# EAGLE design Pihome Boiler Relay (EAGLE 9.0.1)
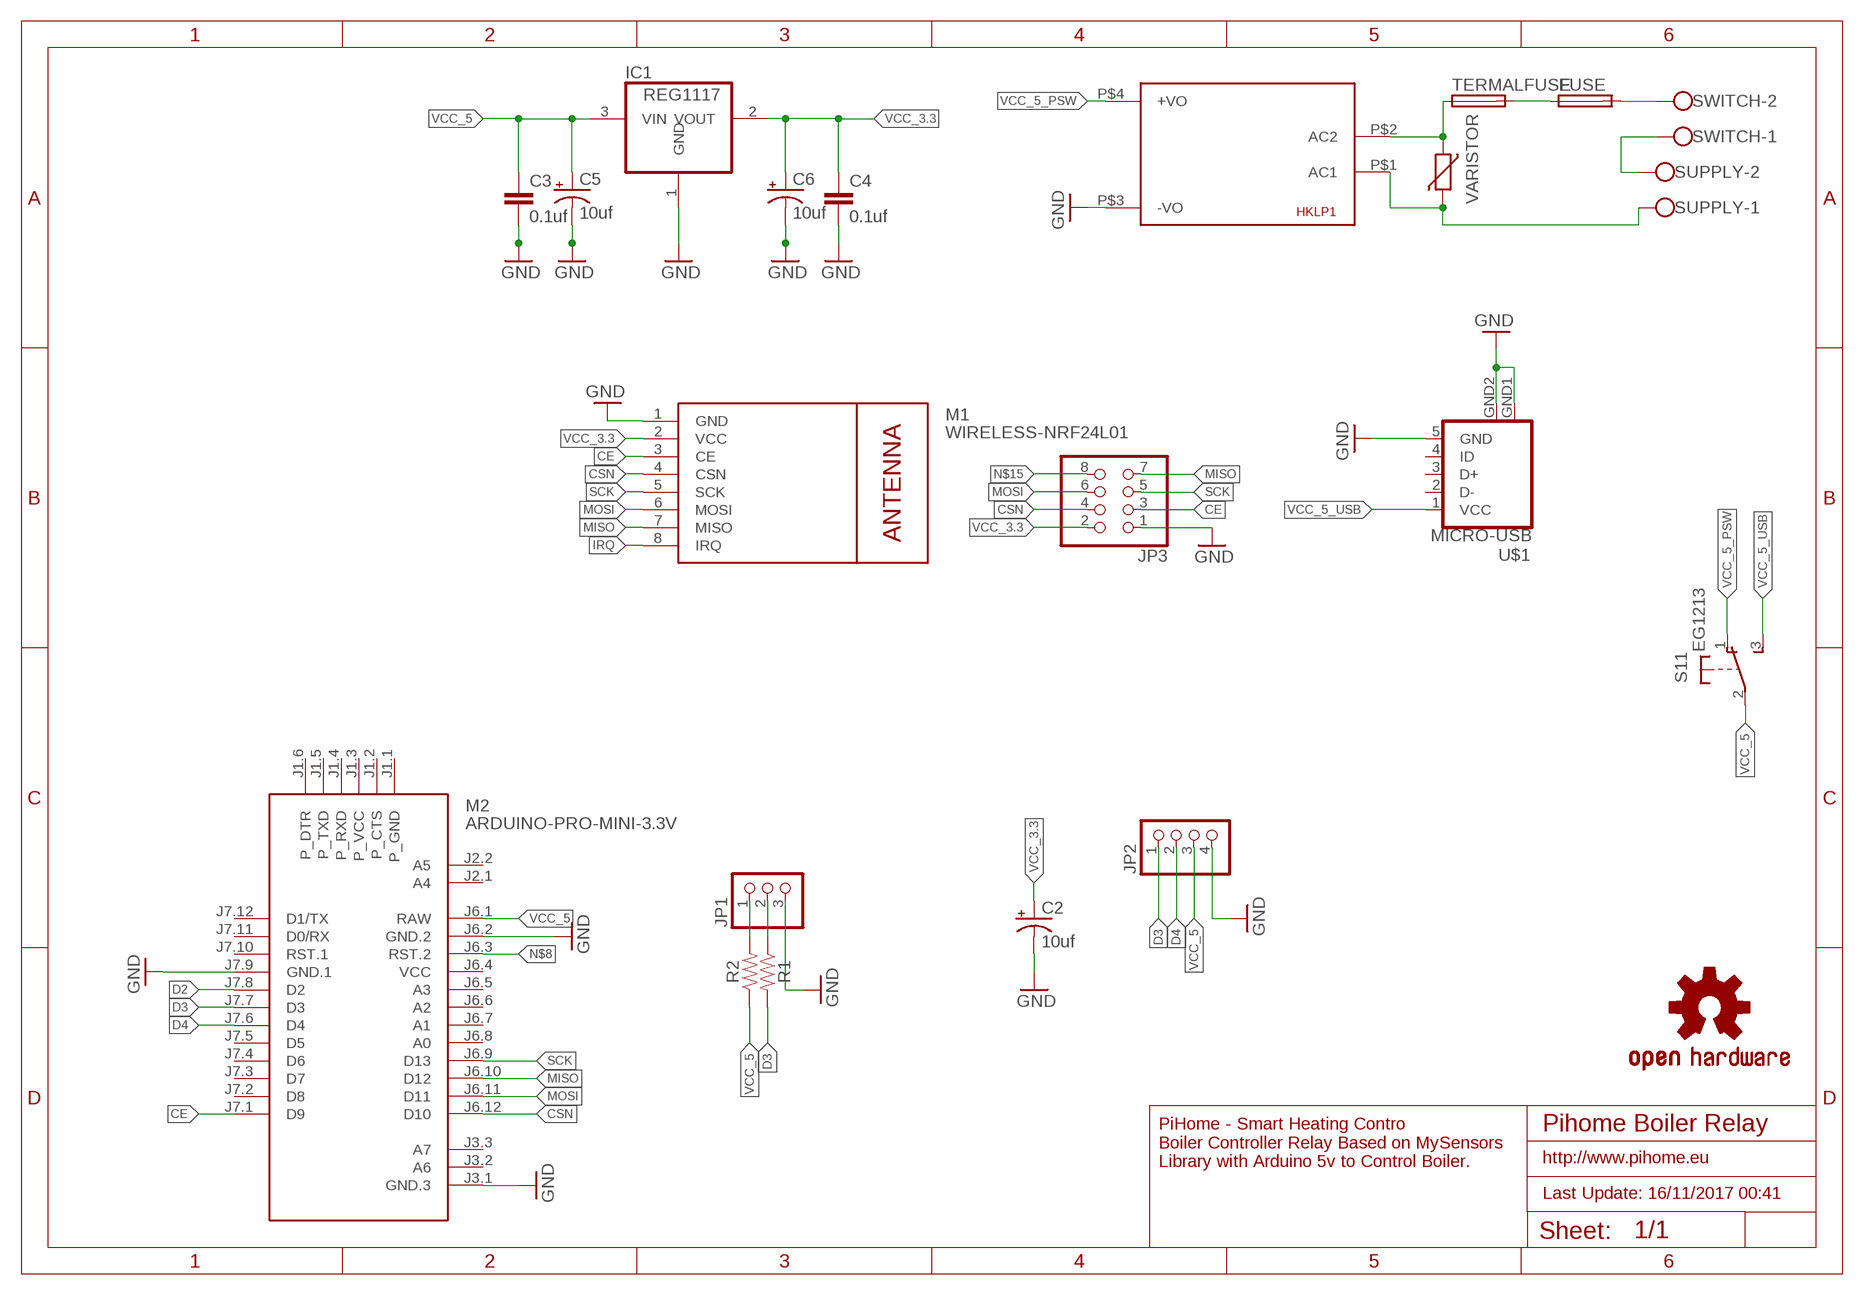
[diagram p0: schematic, sheet 1]

## Parts
C2  10uf  10UF-25V-20%(PTH)KIT  [CPOL-RADIAL-10UF-25V-KIT]
C3  0.1uf  0.1UF-50V-20%(PTH)KIT-EZ  [CAP-PTH-SMALL-KIT]
C4  0.1uf  0.1UF-50V-20%(PTH)KIT-EZ  [CAP-PTH-SMALL-KIT]
C5  10uf  10UF-25V-20%(PTH)KIT  [CPOL-RADIAL-10UF-25V-KIT]
C6  10uf  10UF-25V-20%(PTH)KIT  [CPOL-RADIAL-10UF-25V-KIT]
FUSE  TE5  [TE5]
HKLP1  HKLPM01  [HKLPM01]
IC1  REG1117  [SOT223]
JP1  PINHD-1X3  [1X03]
JP2  PINHD-1X4  [1X04]
JP3  PINHD-2X4  [2X04]
LOGO1  OSHW-LOGOL  [OSHW-LOGO-L]
M1  WIRELESS-NRF24L01  [WIRELESS-NRF24L01]
M2  ARDUINO-PRO-MINI-3.3V  [ARDUINO-PRO-MINI]
R1  RESISTORAXIAL-0.3  [AXIAL-0.3]
R2  RESISTORAXIAL-0.3  [AXIAL-0.3]
S1  EG1213  [EG1213]
SUPPLY  W237-102  [W237-102]
SWITCH  W237-102  [W237-102]
TERMALFUSE  TE5  [TE5]
U$1  MICRO-USB  [MICRO-USB]
VARISTOR  VARISTOR-7,5  [R-7,5]

## Nets
CE: JP3.3 M1.3(CE) M2.J7.1(D9)
CSN: JP3.4 M1.4(CSN) M2.J6.12(D10)
D2: M2.J7.8(D2)
D3: JP2.1 M2.J7.7(D3) R1.P$2
D4: JP2.2 M2.J7.6(D4)
GND: C2.2(-) HKLP1.P$3(-VO) JP1.3 JP2.4 JP3.1 M1.1(GND) M2.J3.1(GND.3) M2.J6.2(GND.2) M2.J7.9(GND.1) U$1.5(GND) U$1.GND1(GND) U$1.GND2(GND)
GND-: C3.2 C4.2 C5.2(-) C6.2(-) IC1.1(GND) ; supply symbol labelled GND
IRQ: M1.8(IRQ)
MISO: JP3.7 M1.7(MISO) M2.J6.10(D12)
MOSI: JP3.6 M1.6(MOSI) M2.J6.11(D11)
N$1: SUPPLY.2 SWITCH.1
N$2: FUSE.1 TERMALFUSE.2
N$3: HKLP1.P$2(AC2) TERMALFUSE.1 VARISTOR.1
N$4: HKLP1.P$1(AC1) SUPPLY.1 VARISTOR.2
N$5: JP1.2 R1.P$1
N$6: JP1.1 R2.P$2
N$7: FUSE.2 SWITCH.2
N$8: M2.J6.3(RST.2)
N$15: JP3.8
SCK: JP3.5 M1.5(SCK) M2.J6.9(D13)
VCC_3.3: C2.1(+) C4.1 C6.1(+) IC1.2(VOUT) JP3.2 M1.2(VCC)
VCC_5: C3.1 C5.1(+) IC1.3(VIN) JP2.3 M2.J6.1(RAW) R2.P$1 S1.2(1:P)
VCC_5_PSW: HKLP1.P$4(+VO) S1.1(1:O)
VCC_5_USB: S1.3(1:S) U$1.1(VCC)
Unconnected: M2.J1.1(P_GND) M2.J1.2(P_CTS) M2.J1.3(P_VCC) M2.J1.4(P_RXD) M2.J1.5(P_TXD) M2.J1.6(P_DTR) M2.J2.1(A4) M2.J2.2(A5) M2.J3.2(A6) M2.J3.3(A7) M2.J6.5(A3) M2.J6.6(A2) M2.J6.7(A1) M2.J6.8(A0) M2.J7.2(D8) M2.J7.3(D7) M2.J7.4(D6) M2.J7.5(D5) M2.J7.10(RST.1) M2.J7.11(D0/RX) M2.J7.12(D1/TX) S1.MT1(MT) S1.MT2(MT) U$1.2(D-) U$1.3(D+) U$1.4(ID)

## Notes on the sheet
- http://www.pihome.eu
- PiHome - Smart Heating Contro
  Boiler Controller Relay Based on MySensors 
  Library with Arduino 5v to Control Boiler.
- Last Update: 16/11/2017 00:41

## Power pins joined to a net without a drawn wire
VCC: M2.J6.4(VCC)

## Library data of the parts
C2 C5 C6 = SparkFun-Capacitors:10UF-25V-20%(PTH): CAP-08440; PROD_ID: CAP-08440
C3 C4 = SparkFun-Capacitors:0.1UF-50V-20%(PTH): CAP-08370; PROD_ID: CAP-08370
FUSE TERMALFUSE = fuse:TE5: FUSE Wickmann; OC_FARNELL: unknown; OC_NEWARK: unknown
HKLP1 = HKLPM01:HKLPM01
IC1 = burr-brown:REG1117: 800mA and 1A Low Dropout (LDO) Positive Regulator 1.8V, 2.5V, 2.85V, 3.3V, 5V, and Adj; MPN: REG1117; OC_FARNELL: 1097566; OC_NEWARK: 14P6981
JP1 = adafruit:PINHD-1X3: PIN HEADER
JP2 = pinhead:PINHD-1X4: PIN HEADER
JP3 = adafruit:PINHD-2X4: PIN HEADER
LOGO1 = SparkFun-Aesthetics:OSHW-LOGO: Open Source Hardware Logo This logo indicates the piece of hardware it is found on incorporates a OSHW license and/or adheres to the definition of open source hardware found here: http://freedomdefined.org/OSHW
M1 = diy-modules:WIRELESS-NRF24L01: 2.4 GHz Wireless Module based on NRF24L01 chip More details available here: http://www.electrodragon.com/w/NRF24L01 Click here to find device on ebay.com <http://www.ebay.com/sch/nrf24l01+arduino>
M2 = diy-modules:ARDUINO-PRO-MINI-*: Arduino Pro Mini and compatible devices More details available here: https://www.arduino.cc/en/Main/ArduinoBoardProMini Click here to find device on ebay.com <http://www.ebay.com/sch/arduino+pro+mini>
R1 R2 = SparkFun-Resistors:RESISTOR: Generic Resistor Package
S1 = adafruit:EG1213: E-Switch right-angle slide SPDT Part #EG1213 http://www.ladyada.net/library/eagle
SUPPLY SWITCH = con-wago-500:W237-102: WAGO SCREW CLAMP; MPN: 237-102; OC_FARNELL: unknown; OC_NEWARK: 70K9898
U$1 = microusb:MICRO-USB: Micro USB B connector
VARISTOR = varistor:VARISTOR: VARISTOR

## Net classes
0 default: width 0.305 mm, drill 0.508 mm, clearance 0.254 mm

## Board
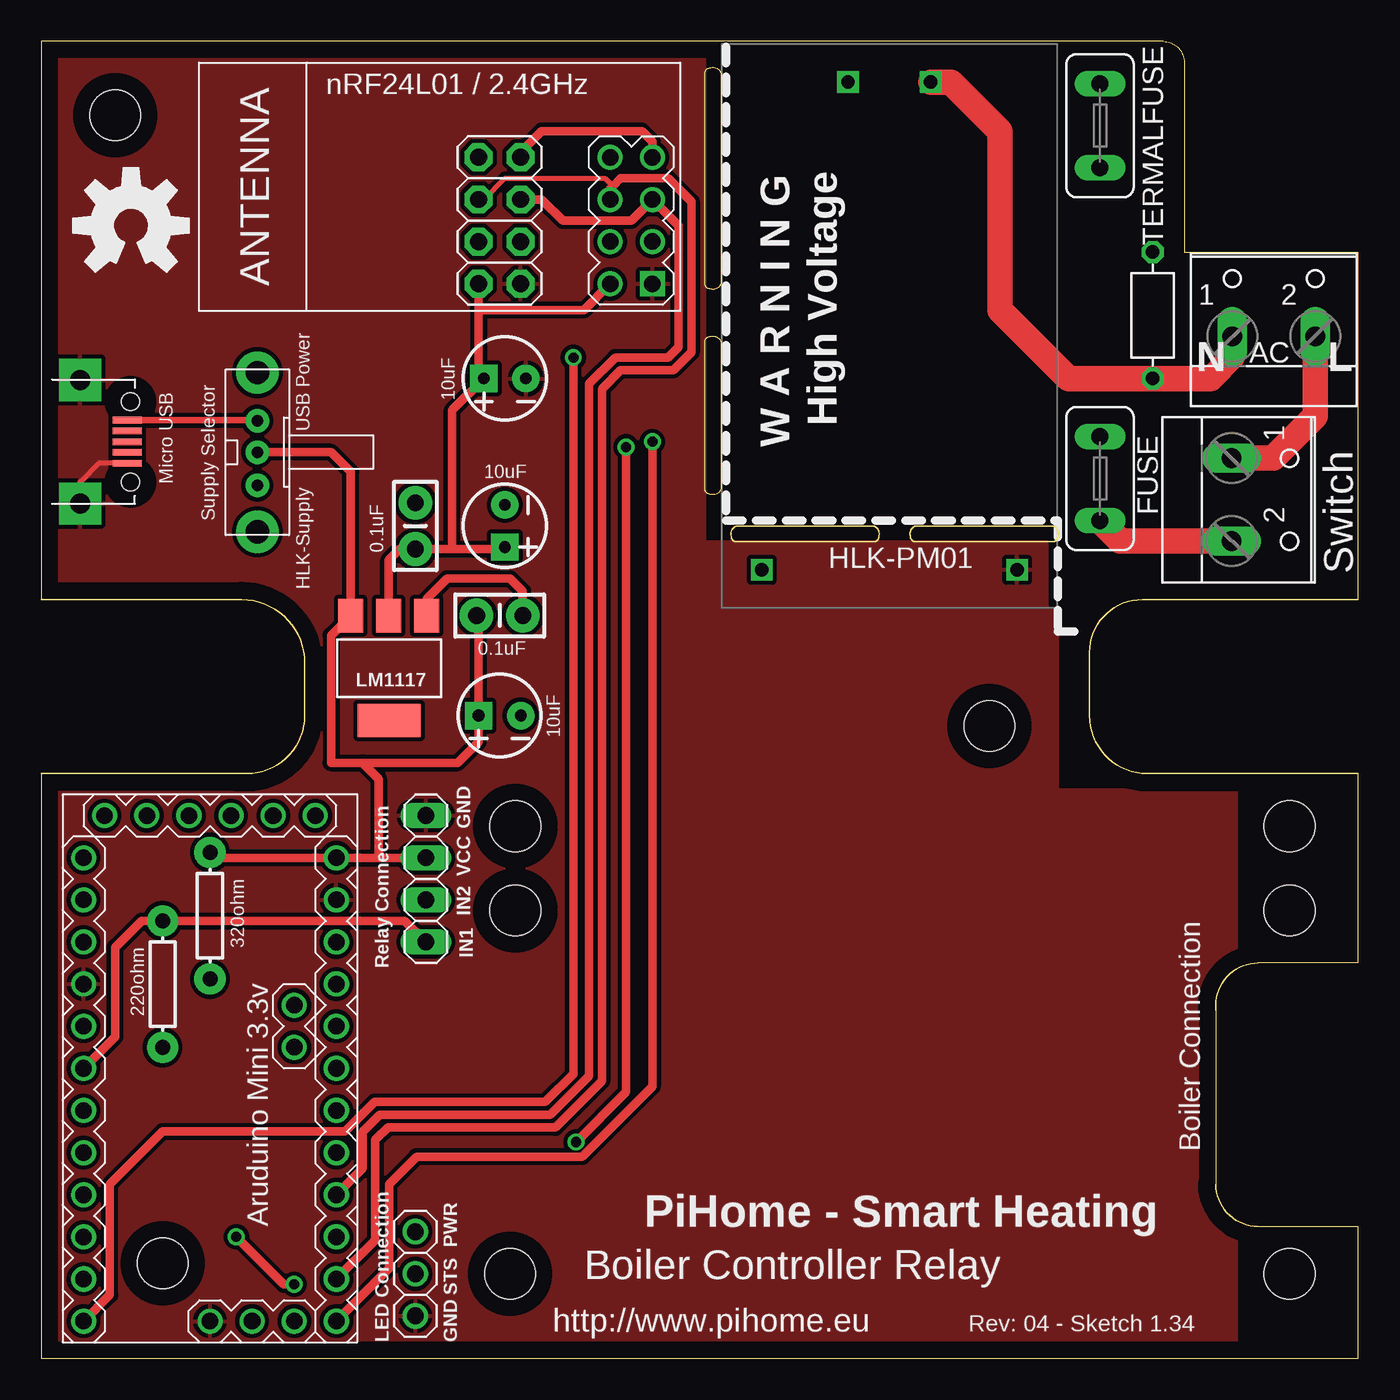
[diagram p1: board, top side]
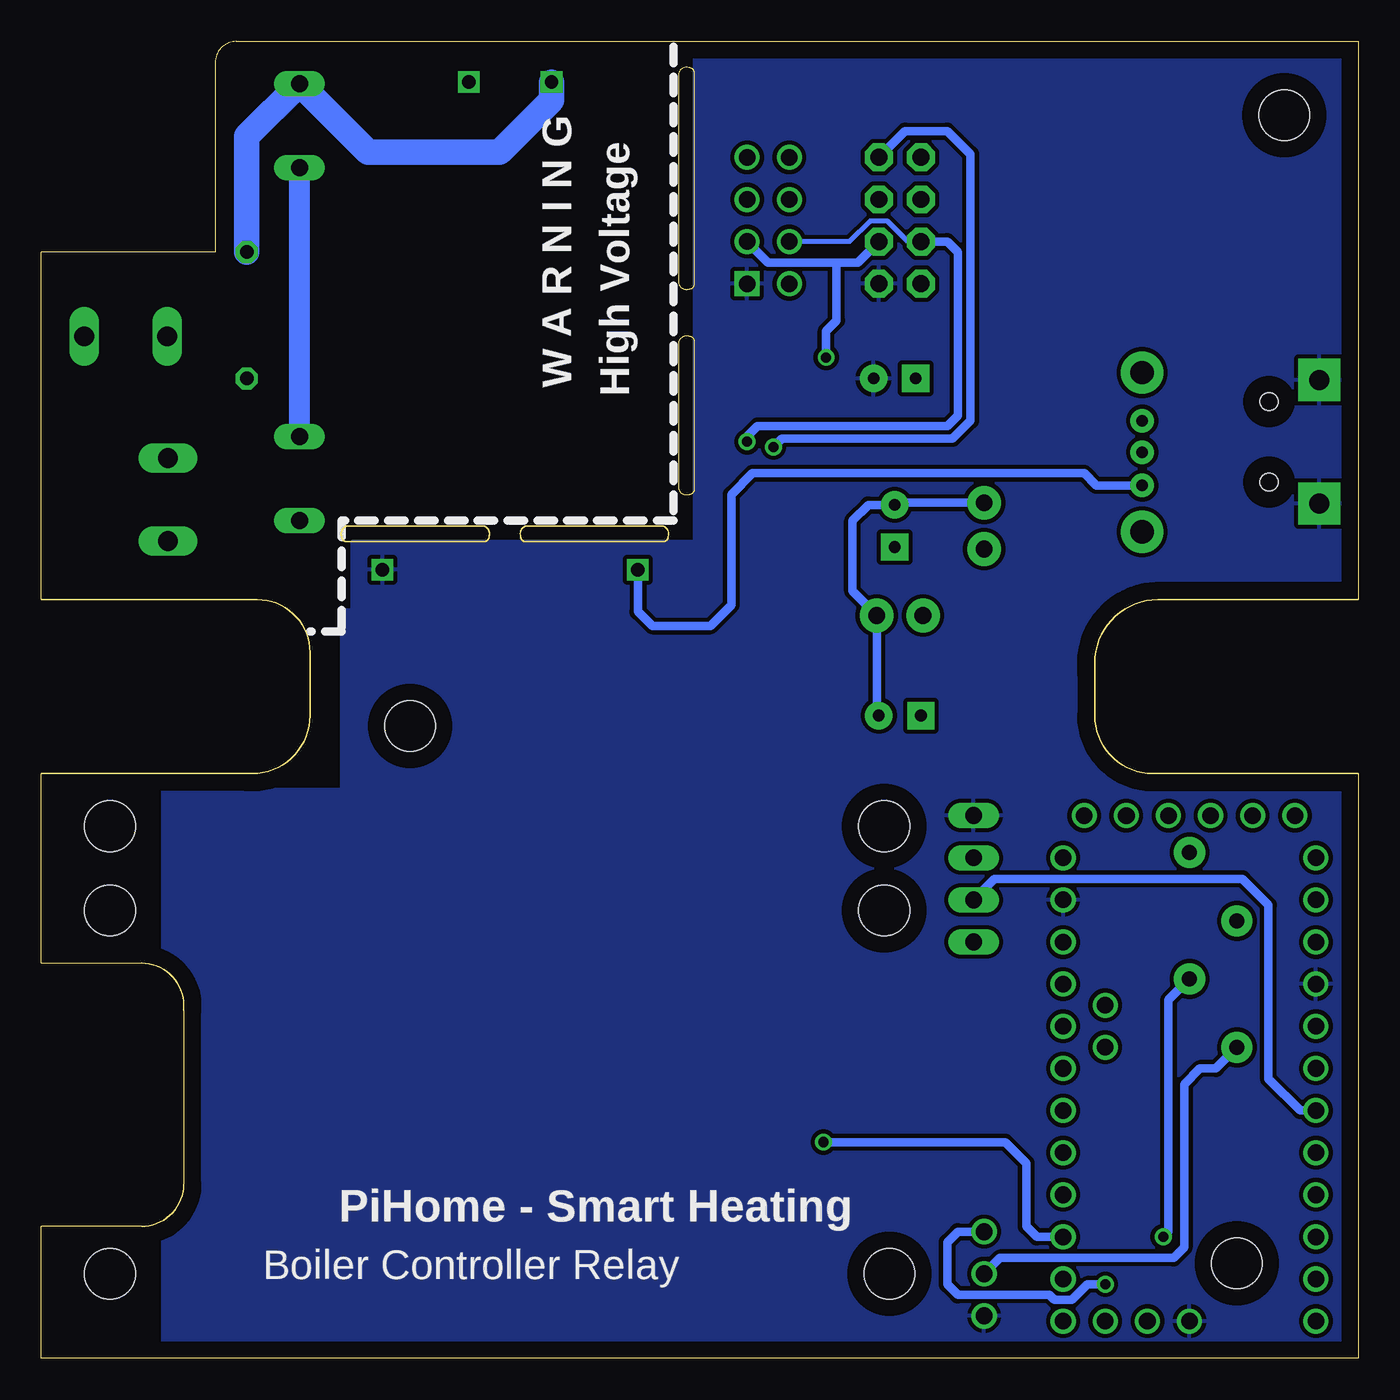
[diagram p2: board, bottom side, seen from below]

Size 79.38 x 79.38 mm. Coordinates in mm from the lower left corner, seen from the top.
Outline: 0,0 79.38,0 79.38,7.94 73.34,7.94 arc-90 70.8,10.48 70.8,20.95 70.8,21.27 arc-90 73.34,23.81 79.38,23.81 79.38,35.24 66.99,35.24 66.67,35.24 arc-90 63.18,38.73 63.18,41.91 63.18,42.55 arc-90 66.36,45.72 79.38,45.72 79.38,66.67 68.9,66.67 68.9,78.11 arc90 67.63,79.38 0,79.38 0,45.72 12.06,45.72 arc-90 15.88,41.91 15.88,41.27 15.88,38.73 arc-90 12.38,35.24 11.75,35.24 0,35.24 0,0
Copper layers (1*16): Top 0.035mm / dielectric 1.5mm / Bottom 0.035mm
Design rules "default": minimum track width 10mil, minimum drill 24mil, track to track 8mil, track to pad 8mil, pad to pad 8mil, via to via 8mil, smd to smd 8mil, copper to edge 40mil, drill to drill 8mil, minimum pad ring 10mil, minimum via ring 8mil, stop-mask expansion 4mil, vias tented up to drill 0mil, thermal gap 10mil
Holes 3.05 mm at 75.25,26.99 28.26,5.08 75.25,5.08 28.57,26.99 75.25,32.07 28.57,32.07 4.45,74.93 57.15,38.1 7.3,5.71
Milling: area 40,64.4 to 41,77.8; area 40,52 to 41,61.6; area 41.6,49.2 to 50.5,50.2; area 52.4,49.2 to 61.3,50.2

### Footprints (pad centres in the part's own frame; a part is rotated, then mirrored left to right if it is on the bottom)
CPOL-RADIAL-10UF-25V-KIT = drill 0.7 pad 1.651 square: 1 1.27,0 | drill 0.7 pad 1.651: 2 -1.27,0
CAP-PTH-SMALL-KIT = drill 1.016 pad 2.032: 1 -1.397,0; 2 1.397,0
TE5 = drill 1.016 long: 1 -2.54,0; 2 2.54,0
HKLPM01 = drill 0.8 square: P$1 -14.7,2.5; P$2 -14.7,-2.5; P$3 14.7,7.7; P$4 14.7,-7.7
SOT223 = smd 1.499 x 2.007: 1 -2.261,-3.15; 2 0.025,-3.15; 3 2.311,-3.15 | smd 3.81 x 2.007: 4 0,3.15
1X03 = drill 1.016: 1 -2.54,0; 2 0,0; 3 2.54,0
1X04 = drill 1.016 long: 1 -3.81,0; 2 -1.27,0; 3 1.27,0; 4 3.81,0
2X04 = drill 1.016 pad 1.676 octagon: 1 -3.81,-1.27; 2 -3.81,1.27; 3 -1.27,-1.27; 4 -1.27,1.27; 5 1.27,-1.27; 6 1.27,1.27; 7 3.81,-1.27; 8 3.81,1.27
WIRELESS-NRF24L01 = drill 1 square: 1 -12.7,6.35 | drill 1: 2 -10.16,6.35; 3 -12.7,3.81; 4 -10.16,3.81; 5 -12.7,1.27; 6 -10.16,1.27; 7 -12.7,-1.27; 8 -10.16,-1.27
ARDUINO-PRO-MINI = drill 1: J1.1 -15.24,6.35; J1.2 -15.24,3.81; J1.3 -15.24,1.27; J1.4 -15.24,-1.27; J1.5 -15.24,-3.81; J1.6 -15.24,-6.35; J2.1 -1.27,5.08; J2.2 -3.81,5.08; J3.1 15.24,0; J3.2 15.24,2.54; J3.3 15.24,5.08; J6.1 -12.7,7.62; J6.2 -10.16,7.62; J6.3 -7.62,7.62; J6.4 -5.08,7.62; J6.5 -2.54,7.62; J6.6 0,7.62; J6.7 2.54,7.62; J6.8 5.08,7.62; J6.9 7.62,7.62; J6.10 10.16,7.62; J6.11 12.7,7.62; J6.12 15.24,7.62; J7.1 15.24,-7.62; J7.2 12.7,-7.62; J7.3 10.16,-7.62; J7.4 7.62,-7.62; J7.5 5.08,-7.62; J7.6 2.54,-7.62; J7.7 0,-7.62; J7.8 -2.54,-7.62; J7.9 -5.08,-7.62; J7.10 -7.62,-7.62; J7.11 -10.16,-7.62; J7.12 -12.7,-7.62
AXIAL-0.3 = drill 0.9 pad 1.88: P$1 -3.81,0; P$2 3.81,0
EG1213 = drill 0.7 pad 1.422: 1 -2,0; 2 0,0; 3 1.9,0 | drill 1.4 pad 2.54: MT1 -4.8,0; MT2 4.8,0
W237-102 = drill 1.194 long: 1 -2.5,-1.27; 2 2.5,-1.27
MICRO-USB = smd 0.4 x 1.75: 1 -1.3,4.525; 2 -0.65,4.525; 3 0,4.525; 4 0.65,4.525; 5 1.3,4.525 | drill 1.2 pad 2.54 square: GND1 -3.725,1.7; GND2 3.725,1.7 | hole 1.05: -2.425,4.73; 2.425,4.73
R-7,5 = drill 0.813 octagon: 1 -3.81,0; 2 3.81,0

### Placement (x,y rotation side)
C2  27.94,59.05 180 top
C3  27.62,44.77 0 top
C4  22.54,50.16 90 top
C5  27.62,38.73 180 top
C6  27.94,50.16 270 top
FUSE  63.82,53.02 270 top
HKLP1  51.12,62.23 270 top
IC1  20.95,41.59 180 top
JP1  22.54,5.08 270 top
JP2  23.18,28.89 90 top
JP3  27.62,68.58 90 top
LOGO1  5.4,68.26 0 top
M1  24.13,71.12 180 top
M2  10.16,17.46 270 top
R1  7.3,22.54 90 top
R2  10.16,26.67 270 top
S1  13.02,54.61 90 top
SUPPLY  74.3,62.87 0 top
SWITCH  73.03,51.75 270 top
TERMALFUSE  63.82,74.3 270 top
U$1  0.64,55.24 270 top
VARISTOR  66.99,62.87 270 top

### Tracks (layer width: path | path; a pad name or v marks a point on that pad's centre or on a via)
CE  (via drill 0.61)
  Top 0.508: v32.07,60.33 32.07,17.14 30.35,15.43 20.07,15.43 18.3,13.65 7.3,13.65 4.13,10.48 4.13,3.81 M2.J7.1
  Bottom 0.508: v32.07,60.33 32.07,61.91 31.43,62.55 31.43,66.04 | M1.3 35.56,66.04 31.43,66.04 | JP3.3 30.16,66.04 31.43,66.04
CSN  (via drill 0.61)
  Top 0.508: M2.J6.12 20.95,5.4 20.95,10.48 22.61,12.13 32.59,12.13 36.83,16.37 v36.83,55.24
  Bottom 0.305: JP3.4 27.13,67.31 28.38,68.56 29.41,68.56 30.65,67.31 M1.4
  Bottom 0.508: JP3.4 24.77,67.31 24.13,66.67 24.13,56.83 24.77,56.2 36.2,56.2 36.83,55.56 v36.83,55.24
D3
  Top 0.508: M2.J7.7 4.45,19.37 4.45,24.77 6.03,26.35 R1.P$2 21.91,26.35 JP2.1
D4
  Bottom 0.508: M2.J7.6 3.49,14.92 5.4,16.83 5.4,27.3 6.98,28.88 21.92,28.88 JP2.2
GND
  Top 0.305: U$1.GND2 2.33,52.82 3.46,53.95 U$1.5
  pour Top: 0,79.06 40.01,79.06 40.01,49.21 60.64,49.21 60.64,45.09 61.28,45.09 61.28,34.29 72.07,34.29 72.07,0 0,0
  pour Bottom: 0,79.06 40.01,79.06 40.01,49.21 60.64,49.21 60.64,45.09 61.28,45.09 61.28,34.29 72.07,34.29 72.07,0 0,0
GND-
  Top 0.305: 23.5,44.45 IC1.1
  Top 0.508: IC1.1 23.22,45.76 24.45,46.99 28.26,46.99 29.02,46.23 C3.2
  Bottom 0.508: C5.2 29.02,38.86 C3.2 30.48,46.23 30.48,50.48 29.53,51.44 C6.2 27.81,51.56 C4.2
MISO  (via drill 0.61)
  Top 0.508: M1.7 36.83,73.34 36.2,73.98 30.16,73.98 28.89,72.71 JP3.7 | v35.24,54.93 35.24,16.03 v32.23,13.02
  Bottom 0.508: M2.J6.10 19.37,7.3 20,7.94 20,11.75 21.27,13.02 v32.23,13.02 | JP3.7 27.3,73.98 24.77,73.98 23.37,72.58 23.37,56.52 24.45,55.44 34.73,55.44 v35.24,54.93
MOSI
  Top 0.305: JP3.6 26.67,69.85 27.94,71.12 33.97,71.12 34.45,70.64
  Top 0.508: M1.6 34.29,70.48 34.45,70.64 34.92,71.12 37.78,71.12 39.18,69.72 39.18,60.64 38.1,59.56 34.92,59.56 33.78,58.42 33.78,16.7 30.98,13.91 20.89,13.91 20.13,13.14 20.13,7.11 M2.J6.11
N$1
  Top 1.524: SWITCH.1 74.25,54.25 76.8,56.79 SUPPLY.2
N$2
  Bottom 1.27: FUSE.1 TERMALFUSE.2
N$3
  Bottom 1.524: VARISTOR.1 66.99,73.66 TERMALFUSE.1 59.69,72.71 51.75,72.71 48.62,75.84 HKLP1.P$2
N$4
  Top 1.524: HKLP1.P$1 54.83,76.93 57.78,73.98 57.78,63.18 61.91,59.05 VARISTOR.2 70.48,59.05 71.8,60.37 SUPPLY.1
N$5
  Bottom 0.508: JP1.2 21.59,6.03 11.11,6.03 10.48,6.67 10.48,16.51 9.53,17.46 8.57,17.46 R1.P$1
N$6  (via drill 0.61)
  Top 0.508: v11.75,7.3 14.61,4.45 v15.24,4.45
  Bottom 0.508: R2.P$2 11.43,21.59 11.43,7.62 v11.75,7.3 | v15.24,4.45 16.31,4.45 17.26,3.5 18.3,3.5 18.61,3.81 24.13,3.81 24.77,4.45 24.77,6.99 24.13,7.62 JP1.1
N$7
  Top 1.524: FUSE.2 65.05,49.25 SWITCH.2
SCK
  Top 0.508: JP3.5 30.16,69.85 31.43,68.58 35.56,68.58 M1.5 38.42,68.26 38.42,60.96 37.78,60.33 34.61,60.33 33.02,58.74 33.02,17.02 30.67,14.67 20.39,14.67 19.37,13.65 19.37,11.43 M2.J6.9
VCC_3.3
  Top 0.305: 20.95,45.09 IC1.2
  Top 0.508: M1.2 32.7,63.18 26.35,63.18 | JP3.2 26.35,63.18 | 26.35,63.18 26.35,59.37 C2.1 24.77,57.15 24.77,48.77 | 24.77,48.77 27.81,48.77 C6.1 | IC1.2 20.93,48.11 21.59,48.77 C4.1 24.77,48.77
VCC_5
  Top 0.305: 18.41,45.09 IC1.3 18.41,44.45
  Top 0.508: S1.2 17.46,54.61 18.64,53.43 IC1.3 17.46,43.56 17.46,35.88 19.37,35.88 | 19.37,35.88 20.32,34.92 20.32,30.16 | 20.32,30.16 M2.J6.1 10.48,30.16 R2.P$1 | 20.32,30.16 JP2.3 | 19.37,35.88 25.08,35.88 26.35,37.15 C5.1 26.35,44.64 C3.1
VCC_5_PSW
  Bottom 0.508: S1.1 15.78,52.61 16.51,53.34 36.51,53.34 37.78,52.07 37.78,45.4 39.05,44.13 42.55,44.13 43.42,45.01 HKLP1.P$4
VCC_5_USB
  Top 0.406: U$1.1 13.02,56.55 S1.3

### Text on the board
tPlace: nRF24L01 / 2.4GHz | N | AC | L | 10uF | High Voltage | W A R N I N G | 10uF | HLK-PM01 | Switch | 10uF | GND | 320ohm | VCC | IN2 | Boiler Connection | 220ohm | IN1 | Relay Connection | PiHome - Smart Heating | Aruduino Mini 3.3v | PWR | Boiler Controller Relay | STS | http://www.pihome.eu | Rev: 04 - Sketch 1.34 | LED Connection | GND
bPlace: W A R N I N G | High Voltage | PiHome - Smart Heating | Boiler Controller Relay
tNames: USB Power | Micro USB | Supply Selector | 0.1uF | HLK-Supply | 0.1uF | LM1117